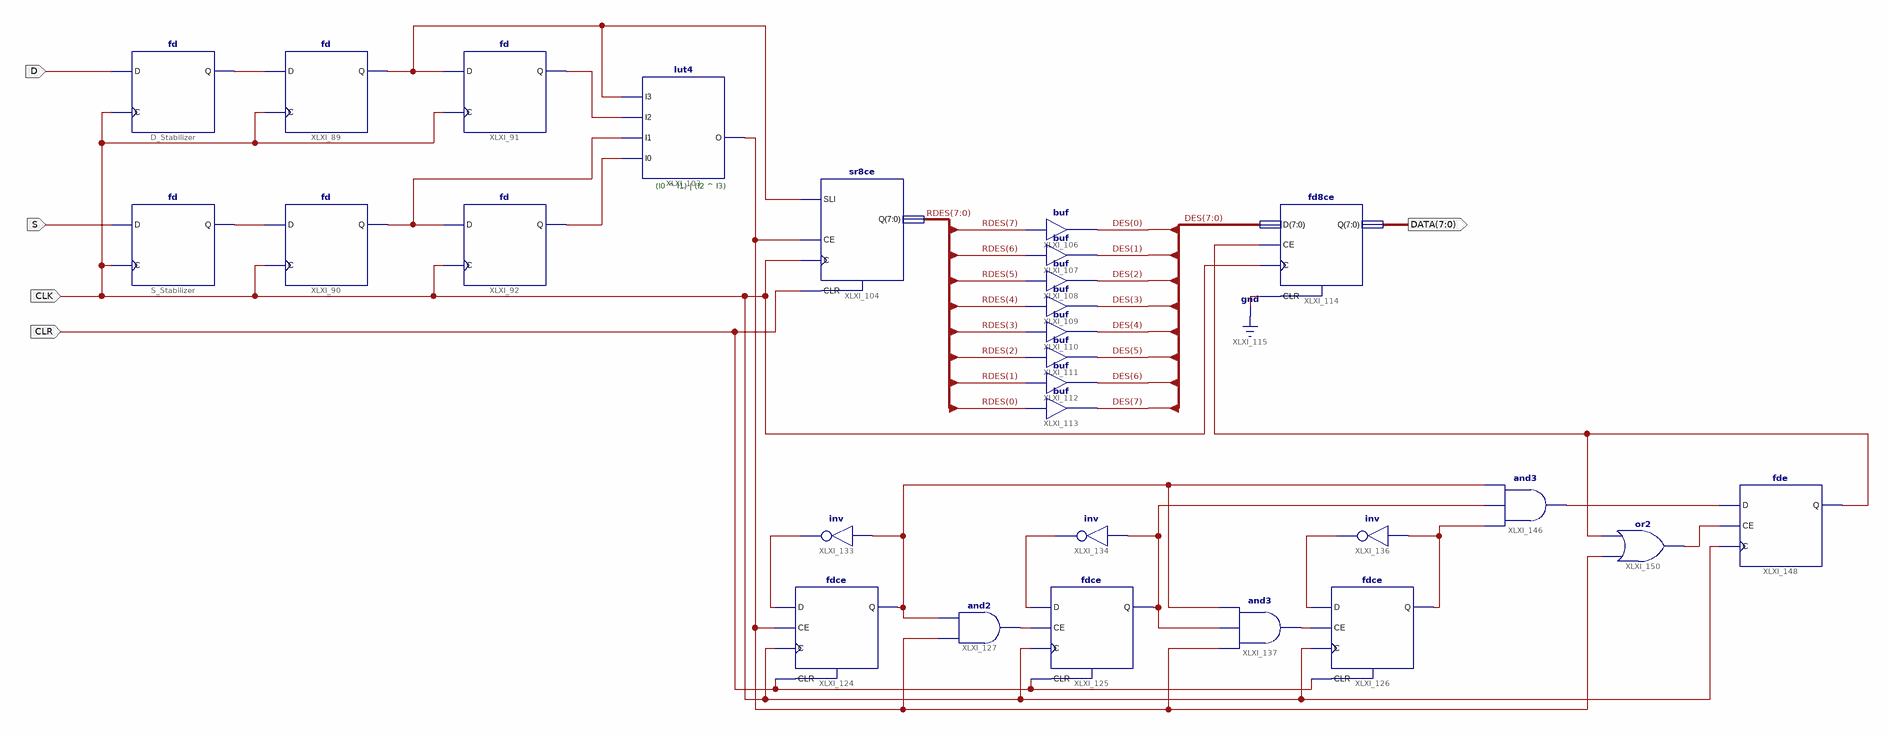
[diagram p0: schematic sheet 1]
// Xilinx ISE schematic receiver.sch (spartan6) as structural Verilog: 28 symbols, 5 ports
module receiver (
  input  D,
  input  S,
  input  CLK,
  input  CLR,
  output [7:0] DATA
);

  wire XLXN_172, XLXN_173, XLXN_198, XLXN_199, XLXN_200, XLXN_201, XLXN_202, XLXN_235, XLXN_236, XLXN_244,
       XLXN_246, XLXN_247, XLXN_253, XLXN_269, XLXN_275, XLXN_279, XLXN_285, XLXN_286;
  wire [7:0] DES, RDES;

  fd XLXI_89 (.C(CLK), .D(XLXN_172), .Q(XLXN_199));
  fd XLXI_90 (.C(CLK), .D(XLXN_173), .Q(XLXN_200));
  fd XLXI_91 (.C(CLK), .D(XLXN_199), .Q(XLXN_198));
  fd XLXI_92 (.C(CLK), .D(XLXN_200), .Q(XLXN_201));
  lut4 #(.INIT("6FF6")) XLXI_103 (.I0(XLXN_201), .I1(XLXN_200), .I2(XLXN_198), .I3(XLXN_199), .O(XLXN_202));
  sr8ce XLXI_104 (.C(CLK), .CE(XLXN_202), .CLR(CLR), .SLI(XLXN_199), .Q(RDES));
  buf XLXI_106 (DES[0], RDES[7]);
  buf XLXI_107 (DES[1], RDES[6]);
  buf XLXI_108 (DES[2], RDES[5]);
  buf XLXI_109 (DES[3], RDES[4]);
  buf XLXI_110 (DES[4], RDES[3]);
  buf XLXI_111 (DES[5], RDES[2]);
  buf XLXI_112 (DES[6], RDES[1]);
  buf XLXI_113 (DES[7], RDES[0]);
  fd8ce XLXI_114 (.C(CLK), .CE(XLXN_286), .CLR(1'b0), .D(DES), .Q(DATA));
  fdce XLXI_124 (.C(CLK), .CE(XLXN_202), .CLR(CLR), .D(XLXN_253), .Q(XLXN_275));
  fdce XLXI_125 (.C(CLK), .CE(XLXN_235), .CLR(CLR), .D(XLXN_244), .Q(XLXN_269));
  and XLXI_127 (XLXN_235, XLXN_202, XLXN_275);
  not XLXI_133 (XLXN_253, XLXN_275);
  not XLXI_134 (XLXN_244, XLXN_269);
  fdce XLXI_126 (.C(CLK), .CE(XLXN_236), .CLR(CLR), .D(XLXN_247), .Q(XLXN_246));
  not XLXI_136 (XLXN_247, XLXN_246);
  and XLXI_137 (XLXN_236, XLXN_202, XLXN_269, XLXN_275);
  and XLXI_146 (XLXN_279, XLXN_246, XLXN_269, XLXN_275);
  fde XLXI_148 (.C(CLK), .CE(XLXN_285), .D(XLXN_279), .Q(XLXN_286));
  or XLXI_150 (XLXN_285, XLXN_202, XLXN_286);
  fd D_Stabilizer (.C(CLK), .D(D), .Q(XLXN_172));
  fd S_Stabilizer (.C(CLK), .D(S), .Q(XLXN_173));

  // Notes on the sheet:
  //   (I0 ^ I1) | (I2 ^ I3)
endmodule
